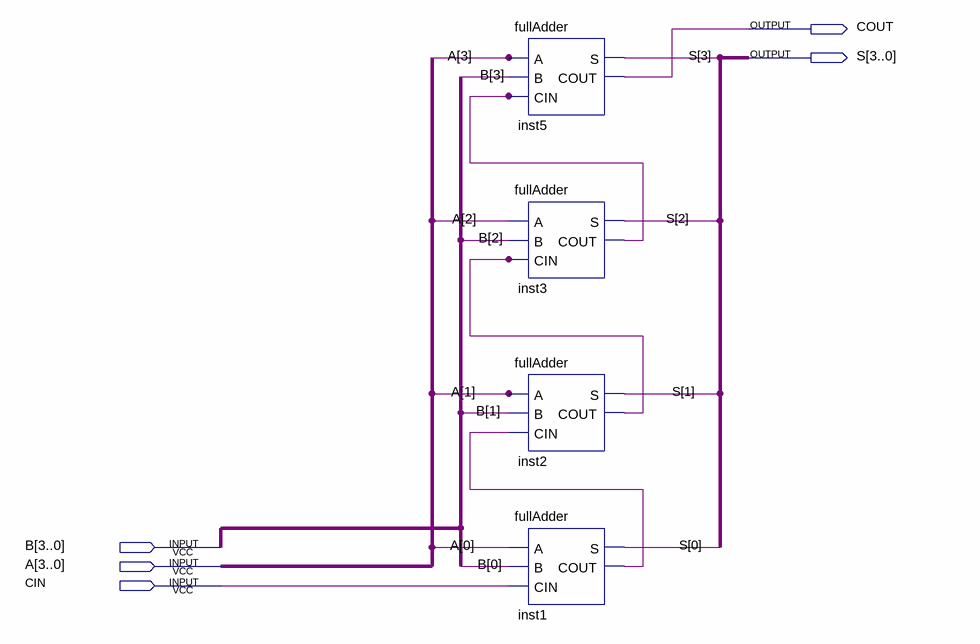
[diagram p0: schematic sheet]
// Quartus schematic rippleCarryAdder4Bit.bdf as structural Verilog: 4 symbols, 5 pins
module rippleCarryAdder4Bit (
  input  [3:0] B,
  input  [3:0] A,
  input  CIN,
  output COUT,
  output [3:0] S
);

  wire inst1_cout, inst2_cout, inst3_cout;

  fullAdder inst5 (.A(A[3]), .B(B[3]), .CIN(inst3_cout), .S(S[3]), .COUT(COUT));
  fullAdder inst3 (.A(A[2]), .B(B[2]), .CIN(inst2_cout), .S(S[2]), .COUT(inst3_cout));
  fullAdder inst2 (.A(A[1]), .B(B[1]), .CIN(inst1_cout), .S(S[1]), .COUT(inst2_cout));
  fullAdder inst1 (.A(A[0]), .B(B[0]), .CIN(CIN), .S(S[0]), .COUT(inst1_cout));
endmodule
